# Altium schematic sheet NxtPX4.SchDoc
size 594 x 420 mm
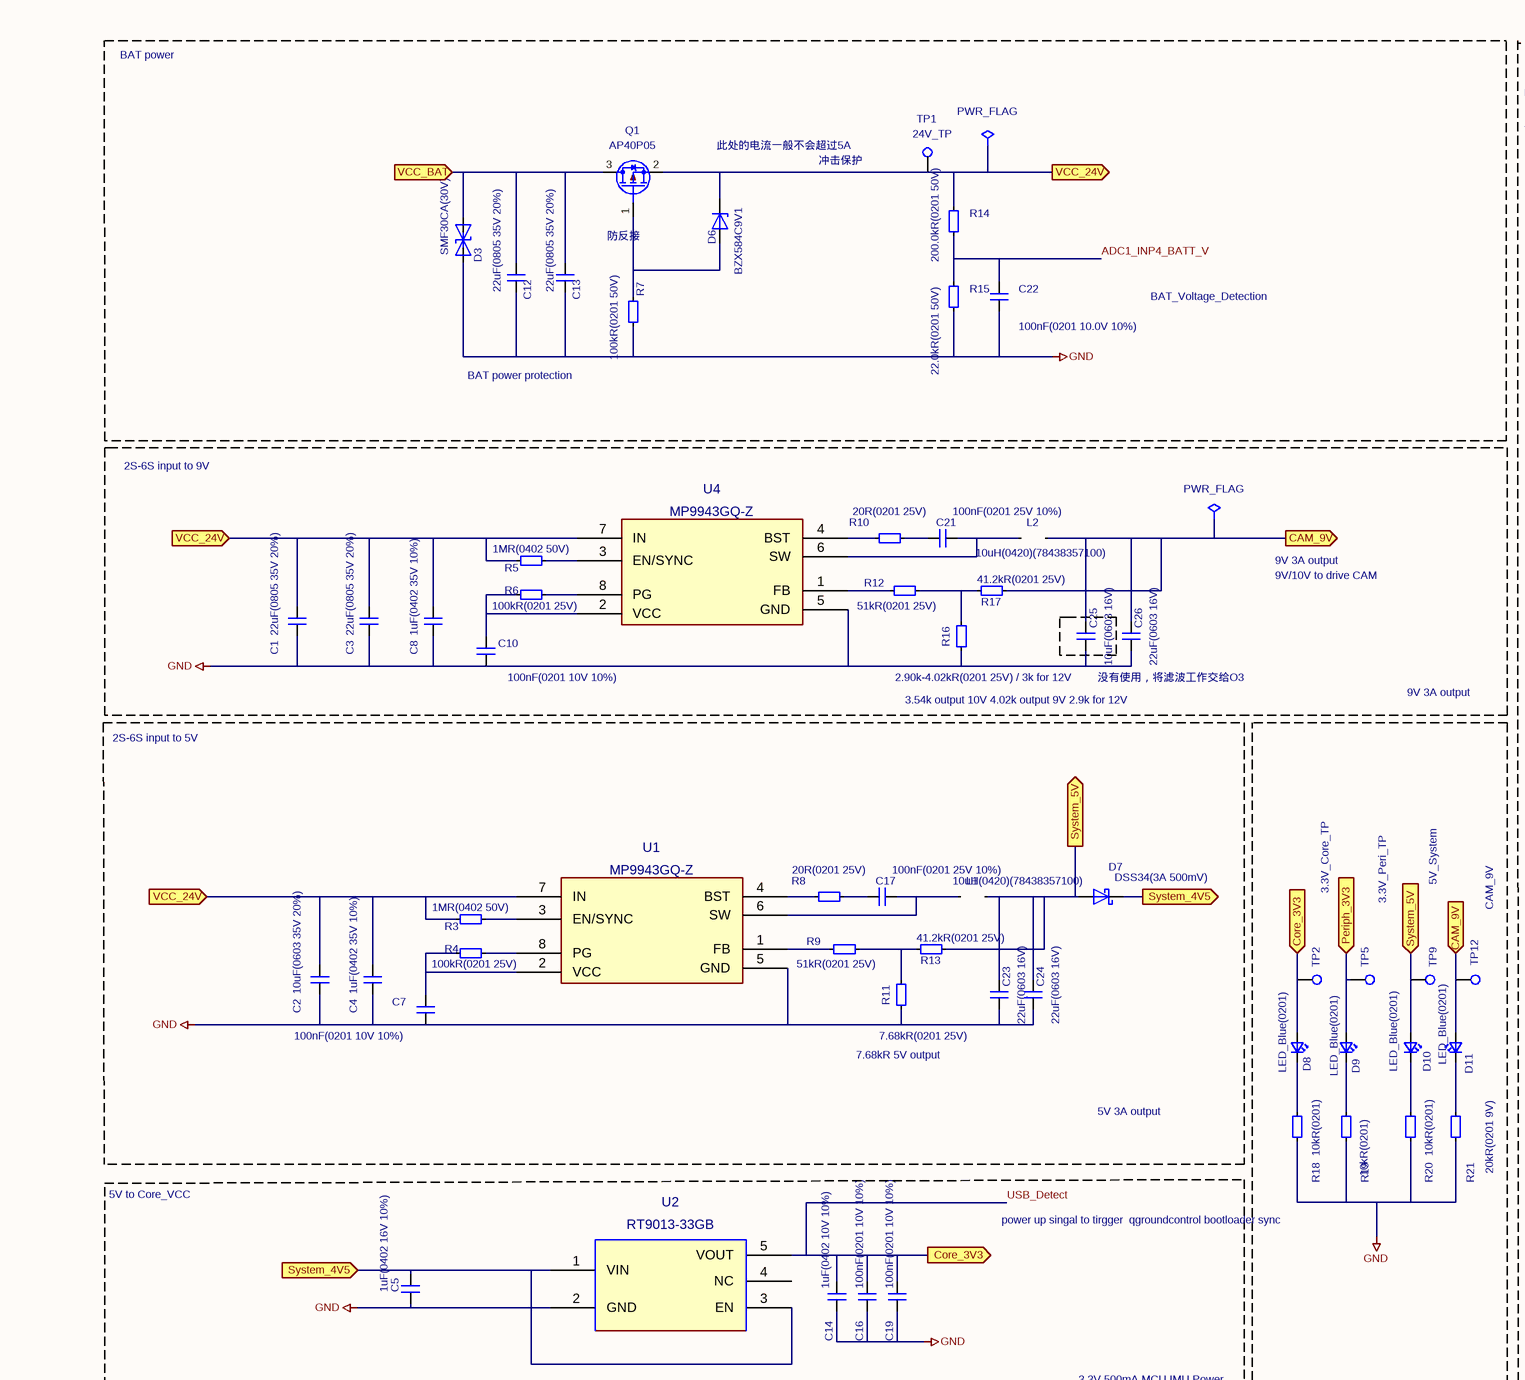
[diagram p0: NxtPX4.SchDoc, top left]
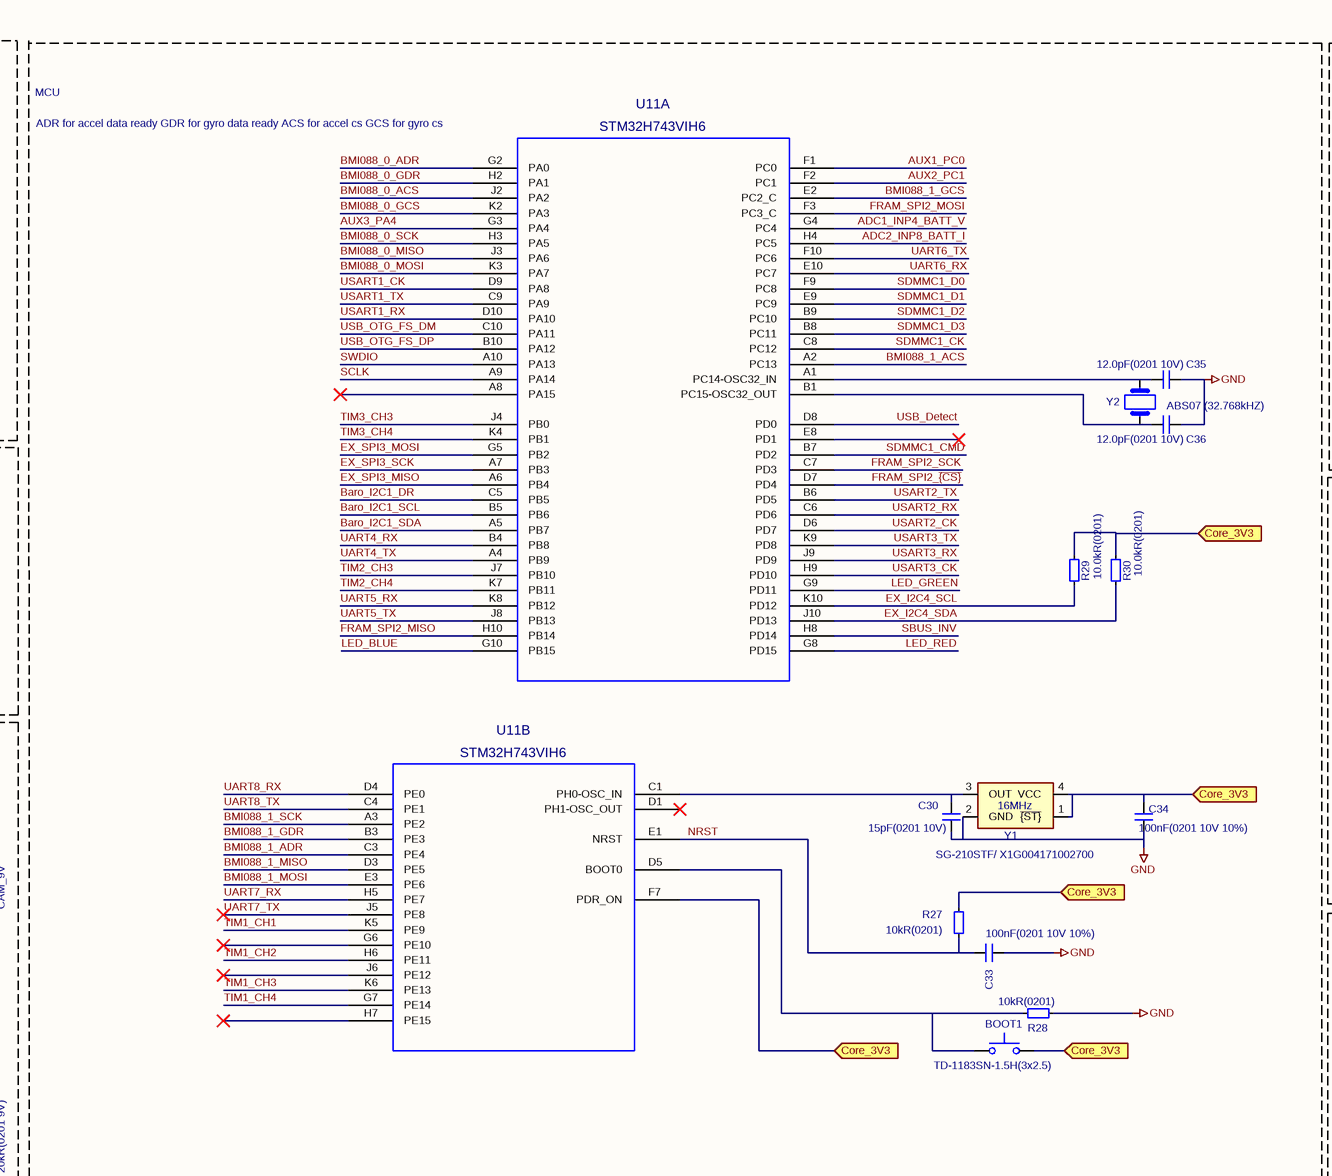
[diagram p1: NxtPX4.SchDoc, top middle]
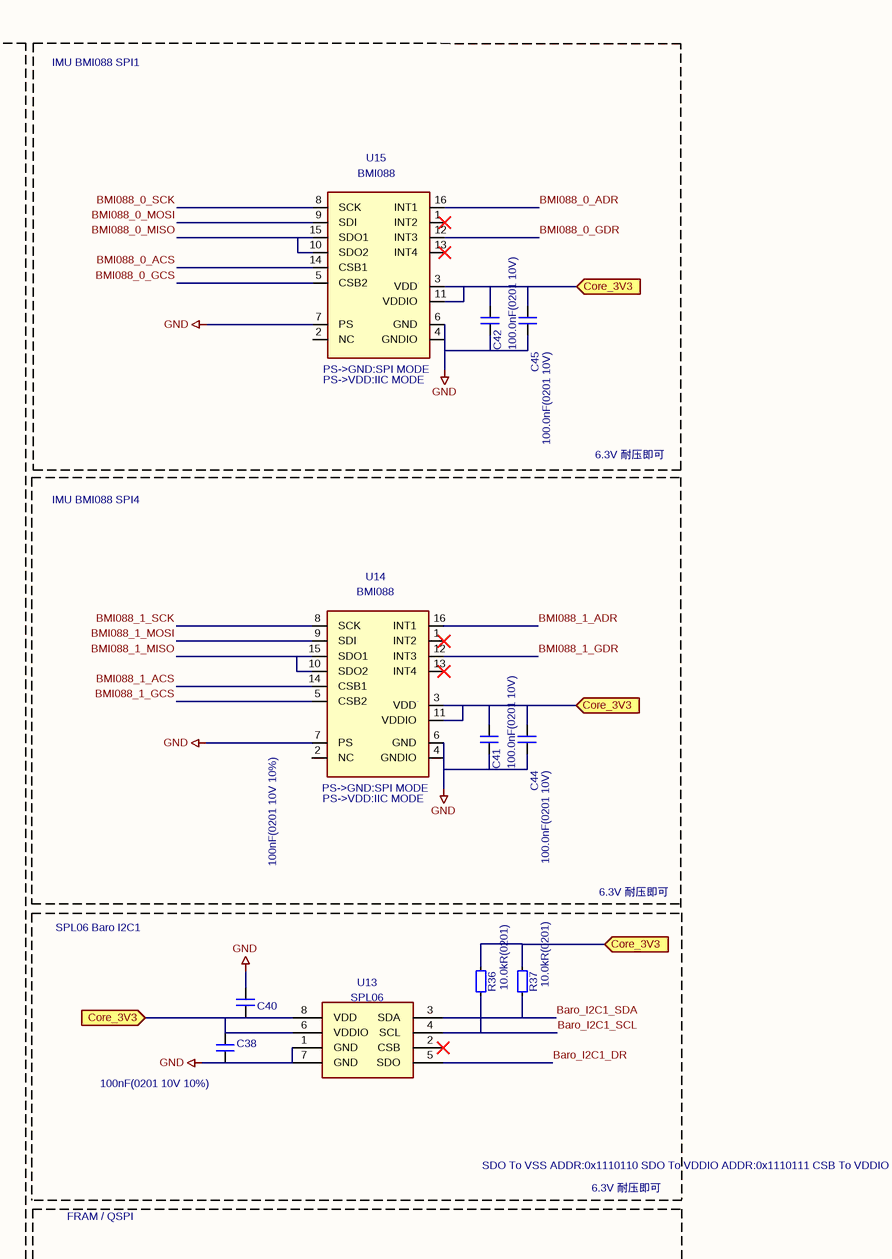
[diagram p2: NxtPX4.SchDoc, top right]
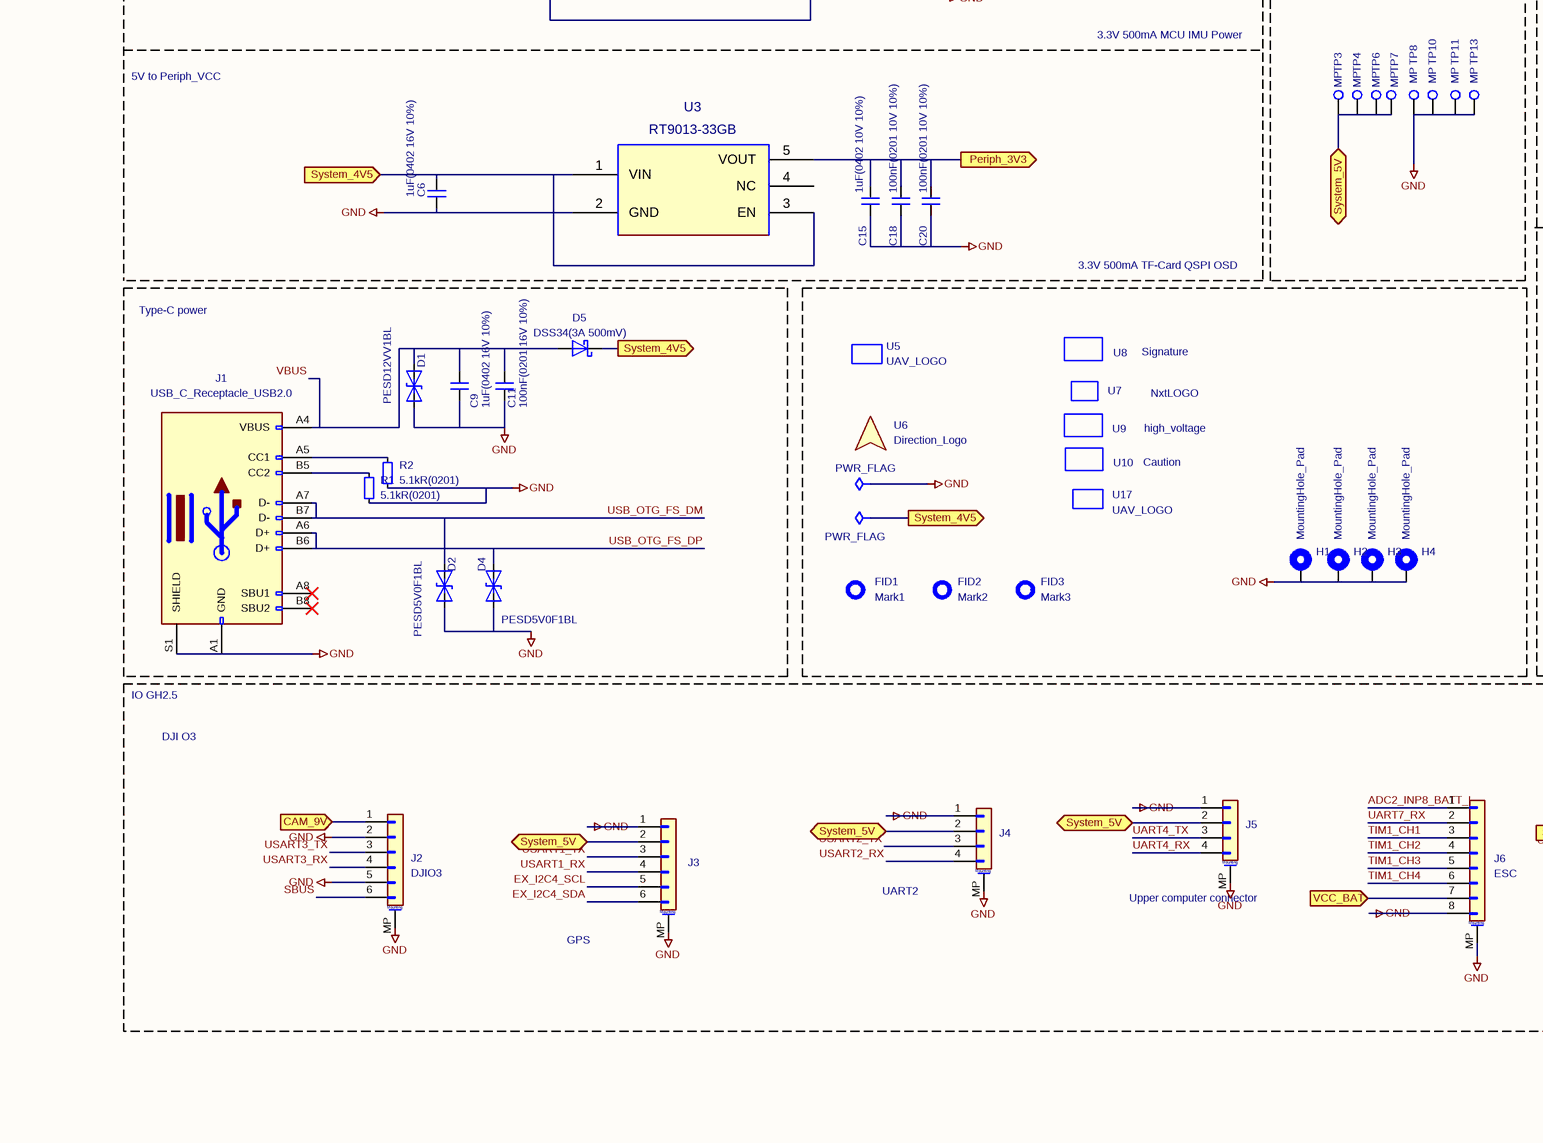
[diagram p3: NxtPX4.SchDoc, bottom left]
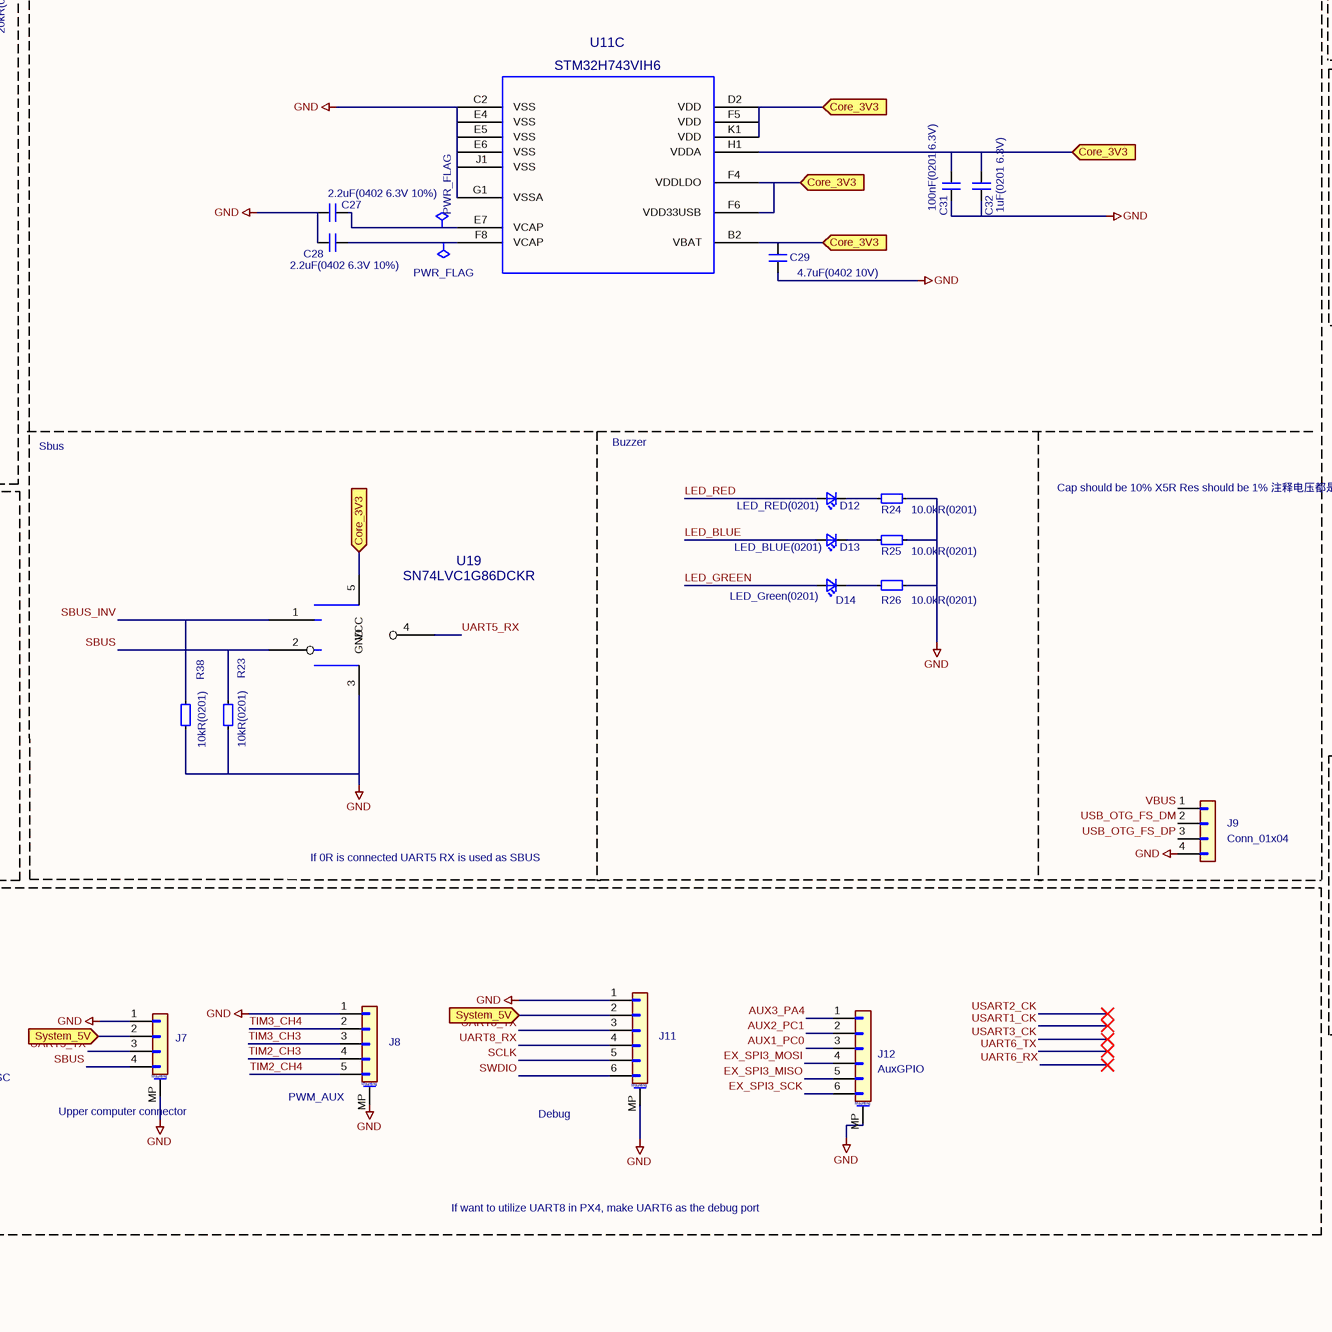
[diagram p4: NxtPX4.SchDoc, bottom middle]
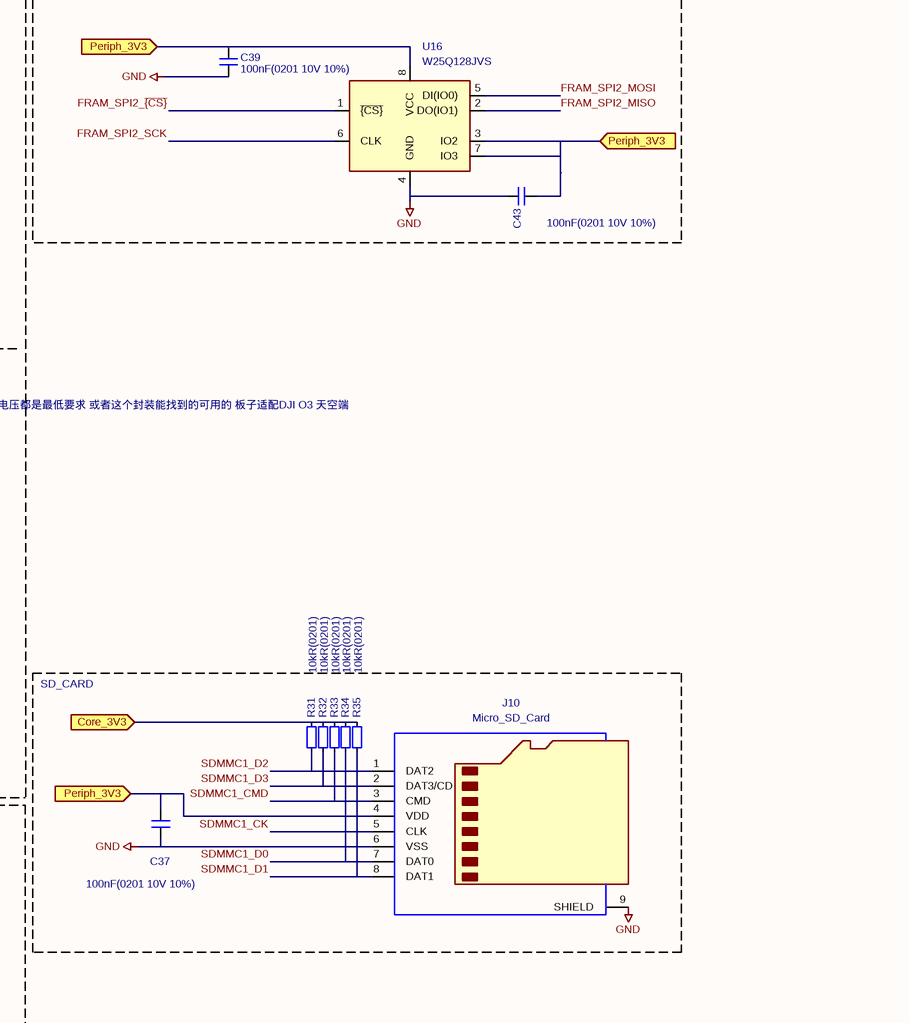
[diagram p5: NxtPX4.SchDoc, bottom right]

## Parts
#FLG01  PWR_FLAG  (graphical)
#FLG02  PWR_FLAG  (graphical)
#FLG03  PWR_FLAG  (graphical)
#FLG04  PWR_FLAG  (graphical)
#FLG05  PWR_FLAG  (graphical)
#FLG06  PWR_FLAG  (graphical)
BOOT1  TD-1183SN-1.5H(3x2.5)  [3x2.5PushButton]
C1  22uF(0805 35V 20%)  [C_0805_2012Metric]
C2  10uF(0603 35V 20%)  [C_0603_1608Metric]
C3  22uF(0805 35V 20%)  [C_0805_2012Metric]
C4  1uF(0402 35V 10%)  [C_0402_1005Metric]
C5  1uF(0402 16V 10%)  [C_0402_1005Metric]
C6  1uF(0402 16V 10%)  [C_0402_1005Metric]
C7  100nF(0201 10V 10%)  [C_0201_0603Metric]
C8  1uF(0402 35V 10%)  [C_0402_1005Metric]
C9  1uF(0402 16V 10%)  [C_0402_1005Metric]
C10  100nF(0201 10V 10%)  [C_0201_0603Metric]
C11  100nF(0201 16V 10%)  [C_0201_0603Metric]
C12  22uF(0805 35V 20%)  [C_0805_2012Metric]
C13  22uF(0805 35V 20%)  [C_0805_2012Metric]
C14  1uF(0402 10V 10%)  [C_0402_1005Metric]
C15  1uF(0402 10V 10%)  [C_0402_1005Metric]
C16  100nF(0201 10V 10%)  [C_0201_0603Metric]
C17  100nF(0201 25V 10%)  [C_0201_0603Metric]
C18  100nF(0201 10V 10%)  [C_0201_0603Metric]
C19  100nF(0201 10V 10%)  [C_0201_0603Metric]
C20  100nF(0201 10V 10%)  [C_0201_0603Metric]
C21  100nF(0201 25V 10%)  [C_0201_0603Metric]
C22  100nF(0201 10.0V 10%)  [C_0201_0603Metric]
C23  22uF(0603 16V)  [C_0603_1608Metric]
C24  22uF(0603 16V)  [C_0603_1608Metric]
C25  10uF(0603 16V)  [C_0603_1608Metric]
C26  22uF(0603 16V)  [C_0603_1608Metric]
C27  2.2uF(0402 6.3V 10%)  [C_0402_1005Metric]
C28  2.2uF(0402 6.3V 10%)  [C_0402_1005Metric]
C29  4.7uF(0402 10V)  [C_0402_1005Metric]
C30  15pF(0201 10V)  [C_0201_0603Metric]
C31  100nF(0201 6.3V)  [C_0201_0603Metric]
C32  1uF(0201 6.3V)  [C_0201_0603Metric]
C33  100nF(0201 10V 10%)  [C_0201_0603Metric]
C34  100nF(0201 10V 10%)  [C_0201_0603Metric]
C35  12.0pF(0201 10V)  [C_0201_0603Metric]
C36  12.0pF(0201 10V)  [C_0201_0603Metric]
C37  100nF(0201 10V 10%)  [C_0201_0603Metric]
C38  100nF(0201 10V 10%)  [C_0201_0603Metric]
C39  100nF(0201 10V 10%)  [C_0201_0603Metric]
C40  100nF(0201 10V 10%)  [C_0201_0603Metric]
C41  100.0nF(0201 10V)  [C_0201_0603Metric]
C42  100.0nF(0201 10V)  [C_0201_0603Metric]
C43  100nF(0201 10V 10%)  [C_0201_0603Metric]
C44  100.0nF(0201 10V)  [C_0201_0603Metric]
C45  100.0nF(0201 10V)  [C_0201_0603Metric]
D1  PESD12VV1BL  [PESD12VV1BL_315]
D2  PESD5V0F1BL  [PESD5V0F1BL]
D3  SMF30CA(30V)  [D_SOD-123F]
D4  PESD5V0F1BL  [PESD5V0F1BL]
D5  DSS34(3A 500mV)  [D_SOD-123F]
D6  BZX584C9V1  [D_SOD-523]
D7  DSS34(3A 500mV)  [D_SOD-123F]
D8  LED_Blue(0201)  [LED_0201_0603Metric]
D9  LED_Blue(0201)  [LED_0201_0603Metric]
D10  LED_Blue(0201)  [LED_0201_0603Metric]
D11  LED_Blue(0201)  [LED_0201_0603Metric]
D12  LED_RED(0201)  [LED_0201_0603Metric]
D13  LED_BLUE(0201)  [LED_0201_0603Metric]
D14  LED_Green(0201)  [LED_0201_0603Metric]
FID1  Mark1  [Fidiucial]
FID2  Mark2  [Fidiucial]
FID3  Mark3  [Fidiucial]
H1  MountingHole_Pad  [M2MountingHole]
H2  MountingHole_Pad  [M2MountingHole]
H3  MountingHole_Pad  [M2MountingHole]
H4  MountingHole_Pad  [M2MountingHole]
J1  USB_C_Receptacle_USB2.0  [USB_C_Small]
J2  DJIO3  [1x06-1MP_P1.00mm_Horizontal]
J3  GPS  [1x06-1MP_P1.00mm_Horizontal]
J4  UART2  [01x04_MP_sh1.0_Hori]
J5  Upper computer connector  [01x04_MP_sh1.0_Hori]
J6  ESC  [01x08_MP_sh1.0_Hori]
J7  Upper computer connector  [01x04_MP_sh1.0_Hori]
J8  PWM_AUX  [01x05_MP_sh1.0_Hori]
J9  Conn_01x04  [Conn_4Pin]
J10  Micro_SD_Card  [TF-SMD_TF-021B-H265]
J11  Debug  [1x06-1MP_P1.00mm_Horizontal]
J12  AuxGPIO  [1x06-1MP_P1.00mm_Horizontal]
L1  10uH(0420)(78438357100)  [Inductor_0420]
L2  10uH(0420)(78438357100)  [Inductor_0420]
Q1  AP40P05  [SOT-23]
R1  5.1kR(0201)  [R_0201_0603Metric]
R2  5.1kR(0201)  [R_0201_0603Metric]
R3  1MR(0402 50V)  [R_0402_1005Metric]
R4  100kR(0201 25V)  [R_0201_0603Metric]
R5  1MR(0402 50V)  [R_0402_1005Metric]
R6  100kR(0201 25V)  [R_0201_0603Metric]
R7  100kR(0201 50V)  [R_0201_0603Metric]
R8  20R(0201 25V)  [R_0201_0603Metric]
R9  51kR(0201 25V)  [R_0201_0603Metric]
R10  20R(0201 25V)  [R_0201_0603Metric]
R11  7.68kR(0201 25V)  [R_0201_0603Metric]
R12  51kR(0201 25V)  [R_0201_0603Metric]
R13  41.2kR(0201 25V)  [R_0201_0603Metric]
R14  200.0kR(0201 50V)  [R_0201_0603Metric]
R15  22.0kR(0201 50V)  [R_0201_0603Metric]
R16  2.90k-4.02kR(0201 25V) / 3k for 12V  [R_0201_0603Metric]
R17  41.2kR(0201 25V)  [R_0201_0603Metric]
R18  10kR(0201)  [R_0201_0603Metric]
R19  10kR(0201)  [R_0201_0603Metric]
R20  10kR(0201)  [R_0201_0603Metric]
R21  20kR(0201 9V)  [R_0201_0603Metric]
R23  10kR(0201)  [R_0201_0603Metric]
R24  10.0kR(0201)  [R_0201_0603Metric]
R25  10.0kR(0201)  [R_0201_0603Metric]
R26  10.0kR(0201)  [R_0201_0603Metric]
R27  10kR(0201)  [R_0201_0603Metric]
R28  10kR(0201)  [R_0201_0603Metric]
R29  10.0kR(0201)  [R_0201_0603Metric]
R30  10.0kR(0201)  [R_0201_0603Metric]
R31  10kR(0201)  [R_0201_0603Metric]
R32  10kR(0201)  [R_0201_0603Metric]
R33  10kR(0201)  [R_0201_0603Metric]
R34  10kR(0201)  [R_0201_0603Metric]
R35  10kR(0201)  [R_0201_0603Metric]
R36  10.0kR(0201)  [R_0201_0603Metric]
R37  10.0kR(0201)  [R_0201_0603Metric]
R38  10kR(0201)  [R_0201_0603Metric]
TP1  24V_TP  [MiniTP]
TP2  3.3V_Core_TP  [MiniTP]
TP3  MP  [PWR_Circle]
TP4  MP  [PWR_Circle]
TP5  3.3V_Peri_TP  [MiniTP]
TP6  MP  [PWR_Circle]
TP7  MP  [PWR_Circle]
TP8  MP  [PWR_Circle]
TP9  5V_System  [MiniTP]
TP10  MP  [PWR_Circle]
TP11  MP  [PWR_Circle]
TP12  CAM_9V  [MiniTP]
TP13  MP  [PWR_Circle]
U1  MP9943GQ-Z  [MP9943GQ-Z]
U2  RT9013-33GB  [RT9013-33GB]
U3  RT9013-33GB  [RT9013-33GB]
U4  MP9943GQ-Z  [MP9943GQ-Z]
U5  UAV_LOGO  [Uav_logo]
U6  Direction_Logo  [Direction_Logo]
U7  NxtLOGO  [NxtLOGO]
U8  Signature  [my_signature]
U9  high_voltage  [high_voltage]
U10  Caution  [Caution]
U11  STM32H743VIH6  [STM32H743VIHBGA100C80P10X10_800X800X110N]  (parts A,B,C of 3)
U13  SPL06  [Bosch_LGA-8_2x2.5mm_P0.65mm_ClockwisePinNumbering]
U14  BMI088  [BMI088]
U15  BMI088  [BMI088]
U16  W25Q128JVS  [SOIC-8_5.23x5.23mm_P1.27mm]
U17  UAV_LOGO  [Dual_logo]
U19  SN74LVC1G86DCKR  [DCK5]
Y1  SG-210STF/ X1G004171002700  [Oscillator_SMD_Abracon_ASDMB-4Pin_2.5x2.0mm]
Y2  ABS07 (32.768kHZ)  [LSE(2012)]

## Blocks framed on the sheet
3.3V 500mA TF-Card QSPI OSD: #FLG01 #FLG02 FID1-FID3 H1-H4 U5-U10 U17

## Ports
CAM_9V (in), CAM_9V (out), Core_3V3 (in), Core_3V3 (out), Periph_3V3 (in), Periph_3V3 (out), System_4V5 (in), System_4V5 (out), System_5V (bidir), System_5V (in), System_5V (out), VCC_24V (in), VCC_24V (out), VCC_BAT (in)

## Nets
GND: #FLG01.1(pwr) C1.2 C2.2 C3.2 C4.2 C5.2 C6.2 C7.2 C8.2 C9.2 C10.2 C11.2 C12.2 C13.2 C14.2 C15.2 C16.2 C18.2 C19.2 C20.2 C22.2 C23.2 C24.2 C25.2 C26.2 C27.1 C28.1 C29.1 C30.2 C31.2 C32.2 C33.2 C34.2 C35.2 C36.2 C37.2 C38.2 C39.2 C40.2 C41.2 C42.2 C43.1 C44.2 C45.2 D1.1(A1) D2.1(A1) D3.1(A1) D4.1(A1) H1.1 H2.1 H3.1 H4.1 J1.A1(GND) J1.S1(SHIELD) J2.2(Pin_2) J2.5(Pin_5) J2.MP(MountPin) J3.1(Pin_1) J3.MP(MountPin) J4.1(Pin_1) J4.MP(MountPin) J5.1(Pin_1) J5.MP(MountPin) J6.8(Pin_8) J6.MP(MountPin) J7.1(Pin_1) J7.MP(MountPin) J8.1(Pin_1) J8.MP(MountPin) J9.4(Pin_4) J10.6(VSS) J10.9(SHIELD) J11.1(Pin_1) J11.MP(MountPin) J12.MP(MountPin) R1.1 R2.1 R7.2 R11.1 R15.2 R16.1 R18.1 R19.1 R20.1 R21.1 R23.1 R24.2 R25.2 R26.2 R28.1 R38.1 TP8.1 TP10.1 TP11.1 TP13.1 U1.5(GND) U2.2(GND) U3.2(GND) U4.5(GND) U11.C2(VSS) U11.E4(VSS) U11.E5(VSS) U11.E6(VSS) U11.G1(VSSA) U11.J1(VSS) U13.1(GND) U13.7(GND) U14.4(GNDIO) U14.6(GND) U14.7(PS) U15.4(GNDIO) U15.6(GND) U15.7(PS) U16.4(GND) U19.3(GND) Y1.2(GND)
ADC1_INP4_BATT_V: C22.1 R14.2 R15.1 U11.G4(PC4)
ADC2_INP8_BATT_I: J6.1(Pin_1) U11.H4(PC5)
AUX1_PC0: J12.3(Pin_3) U11.F1(PC0)
AUX2_PC1: J12.2(Pin_2) U11.F2(PC1)
AUX3_PA4: J12.1(Pin_1) U11.G3(PA4)
Baro_I2C1_DR: U11.C5(PB5) U13.5(SDO)
Baro_I2C1_SCL: R36.1 U11.B5(PB6) U13.4(SCL)
Baro_I2C1_SDA: R37.1 U11.A5(PB7) U13.3(SDA)
BMI088_0_ACS: U11.J2(PA2) U15.14(CSB1)
BMI088_0_ADR: U11.G2(PA0) U15.16(INT1)
BMI088_0_GCS: U11.K2(PA3) U15.5(CSB2)
BMI088_0_GDR: U11.H2(PA1) U15.12(INT3)
BMI088_0_MISO: U11.J3(PA6) U15.10(SDO2) U15.15(SDO1)
BMI088_0_MOSI: U11.K3(PA7) U15.9(SDI)
BMI088_0_SCK: U11.H3(PA5) U15.8(SCK)
BMI088_1_ACS: U11.A2(PC13) U14.14(CSB1)
BMI088_1_ADR: U11.C3(PE4) U14.16(INT1)
BMI088_1_GCS: U11.E2(PC2_C) U14.5(CSB2)
BMI088_1_GDR: U11.B3(PE3) U14.12(INT3)
BMI088_1_MISO: U11.D3(PE5) U14.10(SDO2) U14.15(SDO1)
BMI088_1_MOSI: U11.E3(PE6) U14.9(SDI)
BMI088_1_SCK: U11.A3(PE2) U14.8(SCK)
CAM_9V: #FLG04.1(pwr) C25.1 C26.1 D11.2(A) J2.1(Pin_1) L2.2 R17.2 TP12.1 ; port CAM_9V
EX_I2C4_SCL: J3.5(Pin_5) R29.1 U11.K10(PD12)
EX_I2C4_SDA: J3.6(Pin_6) R30.1 U11.J10(PD13)
EX_SPI3_MISO: J12.5(Pin_5) U11.A6(PB4)
EX_SPI3_MOSI: J12.4(Pin_4) U11.G5(PB2)
EX_SPI3_SCK: J12.6(Pin_6) U11.A7(PB3)
FRAM_SPI2_MISO: U11.H10(PB14) U16.2(DO(IO1))
FRAM_SPI2_MOSI: U11.F3(PC3_C) U16.5(DI(IO0))
FRAM_SPI2_SCK: U11.C7(PD3) U16.6(CLK)
FRAM_SPI2_~{{CS}}: U11.D7(PD4) U16.1(~{{CS}})
LED_BLUE: D13.2(A) U11.G10(PB15)
LED_GREEN: D14.2(A) U11.G9(PD11)
LED_RED: D12.2(A) U11.G8(PD15)
NRST: C33.1 R27.2 U11.E1(NRST)
Periph_3V3: C15.1 C18.1 C20.1 C37.1 C39.1 C43.2 D9.2(A) J10.4(VDD) TP5.1 U3.5(VOUT) U16.3(IO2) U16.7(IO3) U16.8(VCC) ; port Periph_3V3
SBUS: J2.6(Pin_6) J7.4(Pin_4) R23.2 U19.2
SBUS_INV: R38.2 U11.H8(PD14) U19.1
SCLK: J11.5(Pin_5) U11.A9(PA14)
SDMMC1_CK: J10.5(CLK) U11.C8(PC12)
SDMMC1_CMD: J10.3(CMD) R33.1 U11.B7(PD2)
SDMMC1_D0: J10.7(DAT0) R34.1 U11.F9(PC8)
SDMMC1_D1: J10.8(DAT1) R35.1 U11.E9(PC9)
SDMMC1_D2: J10.1(DAT2) R31.1 U11.B9(PC10)
SDMMC1_D3: J10.2(DAT3/CD) R32.1 U11.B8(PC11)
SWDIO: J11.6(Pin_6) U11.A10(PA13)
System_4V5: #FLG02.1(pwr) C5.1 C6.1 D5.1(K) D7.1(K) U2.1(VIN) U2.3(EN) U3.1(VIN) U3.3(EN) ; port System_4V5
System_5V: C23.1 C24.1 D7.2(A) D10.2(A) J3.2(Pin_2) J4.2(Pin_2) J5.2(Pin_2) J7.2(Pin_2) J11.2(Pin_2) L1.2 R13.2 TP3.1 TP4.1 TP6.1 TP7.1 TP9.1 ; port System_5V
TIM1_CH1: J6.3(Pin_3) U11.K5(PE9)
TIM1_CH2: J6.4(Pin_4) U11.H6(PE11)
TIM1_CH3: J6.5(Pin_5) U11.K6(PE13)
TIM1_CH4: J6.6(Pin_6) U11.G7(PE14)
TIM2_CH3: J8.4(Pin_4) U11.J7(PB10)
TIM2_CH4: J8.5(Pin_5) U11.K7(PB11)
TIM3_CH3: J8.3(Pin_3) U11.J4(PB0)
TIM3_CH4: J8.2(Pin_2) U11.K4(PB1)
UART4_RX: J5.4(Pin_4) U11.B4(PB8)
UART4_TX: J5.3(Pin_3) U11.A4(PB9)
UART5_RX: U11.K8(PB12) U19.4
UART5_TX: J7.3(Pin_3) U11.J8(PB13)
UART6_RX: U11.E10(PC7)
UART6_TX: U11.F10(PC6)
UART7_RX: J6.2(Pin_2) U11.H5(PE7)
UART7_TX: U11.J5(PE8)
UART8_RX: J11.4(Pin_4) U11.D4(PE0)
UART8_TX: J11.3(Pin_3) U11.C4(PE1)
USART1_CK: U11.D9(PA8)
USART1_RX: J3.4(Pin_4) U11.D10(PA10)
USART1_TX: J3.3(Pin_3) U11.C9(PA9)
USART2_CK: U11.D6(PD7)
USART2_RX: J4.4(Pin_4) U11.C6(PD6)
USART2_TX: J4.3(Pin_3) U11.B6(PD5)
USART3_CK: U11.H9(PD10)
USART3_RX: J2.4(Pin_4) U11.J9(PD9)
USART3_TX: J2.3(Pin_3) U11.K9(PD8)
USB_Detect: BOOT1.1 C14.1 C16.1 C19.1 C29.2 C31.1 C32.1 C34.1 C38.1 C40.1 C41.1 C42.1 C44.1 C45.1 D8.2(A) R27.1 R29.2 R30.2 R31.2 R32.2 R33.2 R34.2 R35.2 R36.2 R37.2 TP2.1 U2.5(VOUT) U11.B2(VBAT) U11.D2(VDD) U11.D8(PD0) U11.F4(VDDLDO) U11.F5(VDD) U11.F6(VDD33USB) U11.F7(PDR_ON) U11.H1(VDDA) U11.K1(VDD) U13.6(VDDIO) U13.8(VDD) U14.3(VDD) U14.11(VDDIO) U15.3(VDD) U15.11(VDDIO) U19.5(VCC) Y1.1(~{{ST}}) Y1.4(VCC) ; port Core_3V3
USB_OTG_FS_DM: D2.2(A2) J1.A7(D-) J1.B7(D-) J9.2(Pin_2) U11.C10(PA11)
USB_OTG_FS_DP: D4.2(A2) J1.A6(D+) J1.B6(D+) J9.3(Pin_3) U11.B10(PA12)
VBUS: C9.1 C11.1 D1.2(A2) D5.2(A) J1.A4(VBUS) J9.1(Pin_1)
VCC_24V: #FLG03.1(pwr) C1.1 C2.1 C3.1 C4.1 C8.1 D6.1(K) Q1.2(S) R3.1 R5.1 R14.1 TP1.1 U1.7(IN) U4.7(IN) ; port VCC_24V
VCC_BAT: C12.1 C13.1 D3.2(A2) J6.7(Pin_7) Q1.3(D) ; port VCC_BAT
Net#FLG05_1: #FLG05.1(pwr) C27.2 U11.E7(VCAP)
Net#FLG06_1: #FLG06.1(pwr) C28.2 U11.F8(VCAP)
NetBOOT1_2: BOOT1.2 R28.2 U11.D5(BOOT0)
NetC7_1: C7.1 R4.1 U1.2(VCC)
NetC10_1: C10.1 R6.1 U4.2(VCC)
NetC17_1: C17.1 R8.2
NetC17_2: C17.2 L1.1 U1.6(SW)
NetC21_1: C21.1 R10.2
NetC21_2: C21.2 L2.1 U4.6(SW)
NetC30_1: C30.1 U11.C1(PH0-OSC_IN) Y1.3(OUT)
NetC35_1: C35.1 U11.A1(PC14-OSC32_IN) Y2.2
NetC36_1: C36.1 U11.B1(PC15-OSC32_OUT) Y2.1
NetD6_2: D6.2(A) Q1.1(G) R7.1
NetD8_1: D8.1(K) R18.2
NetD9_1: D9.1(K) R19.2
NetD10_1: D10.1(K) R20.2
NetD11_1: D11.1(K) R21.2
NetD12_1: D12.1(K) R24.1
NetD13_1: D13.1(K) R25.1
NetD14_1: D14.1(K) R26.1
NetJ1_A5: J1.A5(CC1) R2.2
NetJ1_B5: J1.B5(CC2) R1.2
NetR3_2: R3.2 U1.3(EN/SYNC)
NetR4_2: R4.2 U1.8(PG)
NetR5_2: R5.2 U4.3(EN/SYNC)
NetR6_2: R6.2 U4.8(PG)
NetR8_1: R8.1 U1.4(BST)
NetR9_1: R9.1 U1.1(FB)
NetR9_2: R9.2 R11.2 R13.1
NetR10_1: R10.1 U4.4(BST)
NetR12_1: R12.1 U4.1(FB)
NetR12_2: R12.2 R16.2 R17.1

Not connected (* = marked no-connect by the designer): J1 A8(SBU1)* A9(VBUS) A12(GND) B1(GND) B4(VBUS) B8(SBU2)* B9(VBUS) B12(GND); U2 4(NC); U3 4(NC); U11 A8(PA15)* D1(PH1-OSC_OUT)* E8(PD1)* G6(PE10)* H7(PE15)* J6(PE12)*; U13 2(CSB)*; U14 1(INT2)* 2(NC) 13(INT4)*; U15 1(INT2)* 2(NC) 13(INT4)*

## Notes on the sheet
- BAT power
- IMU BMI088 SPI1
- MCU
- (near U11) ADR for accel data ready
  GDR for gyro data ready
  ACS for accel cs
  GCS for gyro cs
- 此处的电流一般不会超过5A
- 冲击保护
- (near Q1) 防反接
- BAT_Voltage_Detection
- BAT power protection
- 2S-6S input to 9V
- IMU BMI088 SPI4
- 6.3V 耐压即可
- 9V 3A output
- 9V/10V to drive CAM
- 2S-6S input to 5V
- 3.54k output 10V 4.02k output 9V 2.9k for 12V
- 没有使用，将滤波工作交给O3
- SPL06 Baro I2C1
- (near R11) 7.68kR 5V output
- 5V 3A output
- SDO To VSS ADDR:0x1110110
  SDO To VDDIO ADDR:0x1110111
  CSB To VDDIO In I2C Mode
- 5V to Core_VCC
- power up singal to tirgger
  qgroundcontrol bootloader sync
- FRAM / QSPI
- 5V to Periph_VCC
- 3.3V 500mA MCU IMU Power
- Sbus
- Buzzer
- Cap should be 10% X5R
  Res should be 1%
  注释电压都是最低要求 或者这个封装能找到的可用的
  板子适配DJI O3 天空端
- Type-C power
- SD_CARD
- If 0R is connected UART5 RX is used as SBUS
- IO GH2.5
- DJI O3
- If want to utilize UART8 in PX4, make UART6 as the debug port
- 1
- 2
- 3
- 4
- 5
- 6
- 7
- 8
- 9
- 10
- 11
- A
- B
- C
- D
- E
- F
- G
- H
- Title: NxtPX4
- File: NxtPX4.kicad_sch
- Sheet: /
- HKUST Khalil
- KiCad E.D.A.  kicad (5.1.4)-1
- Size: A2
- Date: 2023-03-03
- Rev: V1.0。1
- Id: 1/1
- (in symbol BMI088) PS->GND:SPI MODE; PS->VDD:IIC MODE
- (in symbol Conn_01x04_MountingPin) Mounting
- (in symbol Conn_01x05_MountingPin) Mounting
- (in symbol Conn_01x06_MountingPin) Mounting
- (in symbol Conn_01x08_MountingPin) Mounting
- (in symbol SG-210STF) 16MHz

## Library data of the parts
BOOT1 = SW_Push: Value: TD-1183SN-1.5H(3x2.5); Footprint: NxtPX4:3x2.5PushButton
C1-C45 = C_Small
  C1 C3 C12 C13: Value: 22uF(0805 35V 20%); Footprint: Capacitor_SMD:C_0805_2012Metric
  C2: Value: 10uF(0603 35V 20%); Footprint: Capacitor_SMD:C_0603_1608Metric
  C4 C8: Value: 1uF(0402 35V 10%); Footprint: Capacitor_SMD:C_0402_1005Metric
  C5 C6 C9: Value: 1uF(0402 16V 10%); Footprint: Capacitor_SMD:C_0402_1005Metric
  C7 C10 C16 C18-C20 C33 C34 C37-C40 C43: Value: 100nF(0201 10V 10%); Footprint: Capacitor_SMD:C_0201_0603Metric
  C11: Value: 100nF(0201 16V 10%); Footprint: Capacitor_SMD:C_0201_0603Metric
  C14 C15: Value: 1uF(0402 10V 10%); Footprint: Capacitor_SMD:C_0402_1005Metric
  C17 C21: Value: 100nF(0201 25V 10%); Footprint: Capacitor_SMD:C_0201_0603Metric
  C22: Value: 100nF(0201 10.0V 10%); Footprint: Capacitor_SMD:C_0201_0603Metric
  C23 C24 C26: Value: 22uF(0603 16V); Footprint: Capacitor_SMD:C_0603_1608Metric
  C25: Value: 10uF(0603 16V); Footprint: Capacitor_SMD:C_0603_1608Metric
  C27 C28: Value: 2.2uF(0402 6.3V 10%); Footprint: Capacitor_SMD:C_0402_1005Metric
  C29: Value: 4.7uF(0402 10V); Footprint: Capacitor_SMD:C_0402_1005Metric
  C30: Value: 15pF(0201 10V); Footprint: Capacitor_SMD:C_0201_0603Metric
  C31: Value: 100nF(0201 6.3V); Footprint: Capacitor_SMD:C_0201_0603Metric
  C32: Value: 1uF(0201 6.3V); Footprint: Capacitor_SMD:C_0201_0603Metric
  C35 C36: Value: 12.0pF(0201 10V); Footprint: Capacitor_SMD:C_0201_0603Metric
  C41 C42 C44 C45: Value: 100.0nF(0201 10V); Footprint: Capacitor_SMD:C_0201_0603Metric
D1 D2 D4 = ESD9B5.0ST5G
  D1: Value: PESD12VV1BL; Footprint: NxtPX4:PESD12VV1BL_315
  D2 D4: Value: PESD5V0F1BL; Footprint: NxtPX4:PESD5V0F1BL
D3 = D_TVS: Value: SMF30CA(30V); Footprint: Diode_SMD:D_SOD-123F
D5 D7 = D_Schottky: Value: DSS34(3A 500mV); Footprint: Diode_SMD:D_SOD-123F
D6 = D_Zener: Value: BZX584C9V1; Footprint: Diode_SMD:D_SOD-523
D8-D14 = LED_Small: Footprint: LED_SMD:LED_0201_0603Metric
  D8-D11: Value: LED_Blue(0201)
  D12: Value: LED_RED(0201)
  D13: Value: LED_BLUE(0201)
  D14: Value: LED_Green(0201)
FID1-FID3 = Fiducial: Footprint: NxtPX4:Fidiucial
  FID1: Value: Mark1
  FID2: Value: Mark2
  FID3: Value: Mark3
J2 J3 J11 J12 = Conn_01x06_MountingPin: Footprint: NxtPX4:1x06-1MP_P1.00mm_Horizontal
  J2: Value: DJIO3
  J3: Value: GPS
  J11: Value: Debug
  J12: Value: AuxGPIO
J4 J5 J7 = Conn_01x04_MountingPin: Footprint: NxtPX4:01x04_MP_sh1.0_Hori
  J4: Value: UART2
  J5 J7: Value: Upper computer connector
J6 = Conn_01x08_MountingPin: Value: ESC; Footprint: NxtPX4:01x08_MP_sh1.0_Hori
J8 = Conn_01x05_MountingPin: Value: PWM_AUX; Footprint: NxtPX4:01x05_MP_sh1.0_Hori
L1 L2 = L_Small: Value: 10uH(0420)(78438357100); Footprint: NxtPX4:Inductor_0420
Q1 = Q_PMOS_GSD: Value: AP40P05; Footprint: Package_TO_SOT_SMD:SOT-23
R1-R21 R23-R38 = R_Small
  R1 R2: Value: 5.1kR(0201); Footprint: Resistor_SMD:R_0201_0603Metric
  R3 R5: Value: 1MR(0402 50V); Footprint: Resistor_SMD:R_0402_1005Metric
  R4 R6: Value: 100kR(0201 25V); Footprint: Resistor_SMD:R_0201_0603Metric
  R7: Value: 100kR(0201 50V); Footprint: Resistor_SMD:R_0201_0603Metric
  R8 R10: Value: 20R(0201 25V); Footprint: Resistor_SMD:R_0201_0603Metric
  R9 R12: Value: 51kR(0201 25V); Footprint: Resistor_SMD:R_0201_0603Metric
  R11: Value: 7.68kR(0201 25V); Footprint: Resistor_SMD:R_0201_0603Metric
  R13 R17: Value: 41.2kR(0201 25V); Footprint: Resistor_SMD:R_0201_0603Metric
  R14: Value: 200.0kR(0201 50V); Footprint: Resistor_SMD:R_0201_0603Metric
  R15: Value: 22.0kR(0201 50V); Footprint: Resistor_SMD:R_0201_0603Metric
  R16: Value: 2.90k-4.02kR(0201 25V) / 3k for 12V; Footprint: Resistor_SMD:R_0201_0603Metric
  R18-R20 R23 R27 R28 R31-R35 R38: Value: 10kR(0201); Footprint: Resistor_SMD:R_0201_0603Metric
  R21: Value: 20kR(0201 9V); Footprint: Resistor_SMD:R_0201_0603Metric
  R24-R26 R29 R30 R36 R37: Value: 10.0kR(0201); Footprint: Resistor_SMD:R_0201_0603Metric
TP1-TP13 = TestPoint
  TP1: Value: 24V_TP; Footprint: NxtPX4:MiniTP
  TP2: Value: 3.3V_Core_TP; Footprint: NxtPX4:MiniTP
  TP3 TP4 TP6-TP8 TP10 TP11 TP13: Value: MP; Footprint: NxtPX4:PWR_Circle
  TP5: Value: 3.3V_Peri_TP; Footprint: NxtPX4:MiniTP
  TP9: Value: 5V_System; Footprint: NxtPX4:MiniTP
  TP12: Value: CAM_9V; Footprint: NxtPX4:MiniTP
U9 = High_Voltage_Logo: Value: high_voltage; Footprint: NxtPX4:high_voltage
U10 = Caution_Logo: Value: Caution; Footprint: NxtPX4:Caution
U17 = Dual_Logo: Value: UAV_LOGO; Footprint: NxtPX4:Dual_logo
Y1 = SG-210STF: Value: SG-210STF/ X1G004171002700; Footprint: Oscillator:Oscillator_SMD_Abracon_ASDMB-4Pin_2.5x2.0mm
Y2 = LSE-Oscillator: Value: ABS07 (32.768kHZ); Footprint: NxtPX4:LSE(2012)
#FLG01 #FLG02 #FLG03 #FLG04 #FLG05 #FLG06 = PWR_FLAG: Value: PWR_FLAG
H1-H4 = MountingHole_Pad: Value: MountingHole_Pad; Footprint: NxtPX4:M2MountingHole
J1 = USB_C_Receptacle_USB2.0: Value: USB_C_Receptacle_USB2.0; Footprint: NxtPX4:USB_C_Small
J9 = Conn_01x04: Value: Conn_01x04; Footprint: NxtPX4:Conn_4Pin
J10 = Micro_SD_Card: Value: Micro_SD_Card; Footprint: NxtPX4:TF-SMD_TF-021B-H265
U1 U4 = MP9943GQ-Z: Value: MP9943GQ-Z; Footprint: NxtPX4:MP9943GQ-Z
U2 U3 = RT9013-33GB: Value: RT9013-33GB; Footprint: NxtPX4:RT9013-33GB
U5 = UAV_LOGO: Value: UAV_LOGO; Footprint: NxtPX4:Uav_logo
U6 = Direction_Logo: Value: Direction_Logo; Footprint: NxtPX4:Direction_Logo
U7 = NxtLogo: Value: NxtLOGO; Footprint: NxtPX4:NxtLOGO
U8 = Signature: Value: Signature; Footprint: NxtPX4:my_signature
U11 = STM32H743VIH6: Value: STM32H743VIH6; Footprint: NxtPX4:STM32H743VIHBGA100C80P10X10_800X800X110N
U13 = SPL06: Value: SPL06; Footprint: Package_LGA:Bosch_LGA-8_2x2.5mm_P0.65mm_ClockwisePinNumbering
U14 U15 = BMI088: Value: BMI088; Footprint: NxtPX4:BMI088
U16 = W25Q128JVS: Value: W25Q128JVS; Footprint: Package_SO:SOIC-8_5.23x5.23mm_P1.27mm
U19 = SN74LVC1G86DCKR: Value: SN74LVC1G86DCKR